# EAGLE design BSE_APPS_Error_Detection (EAGLE 8.4.1)
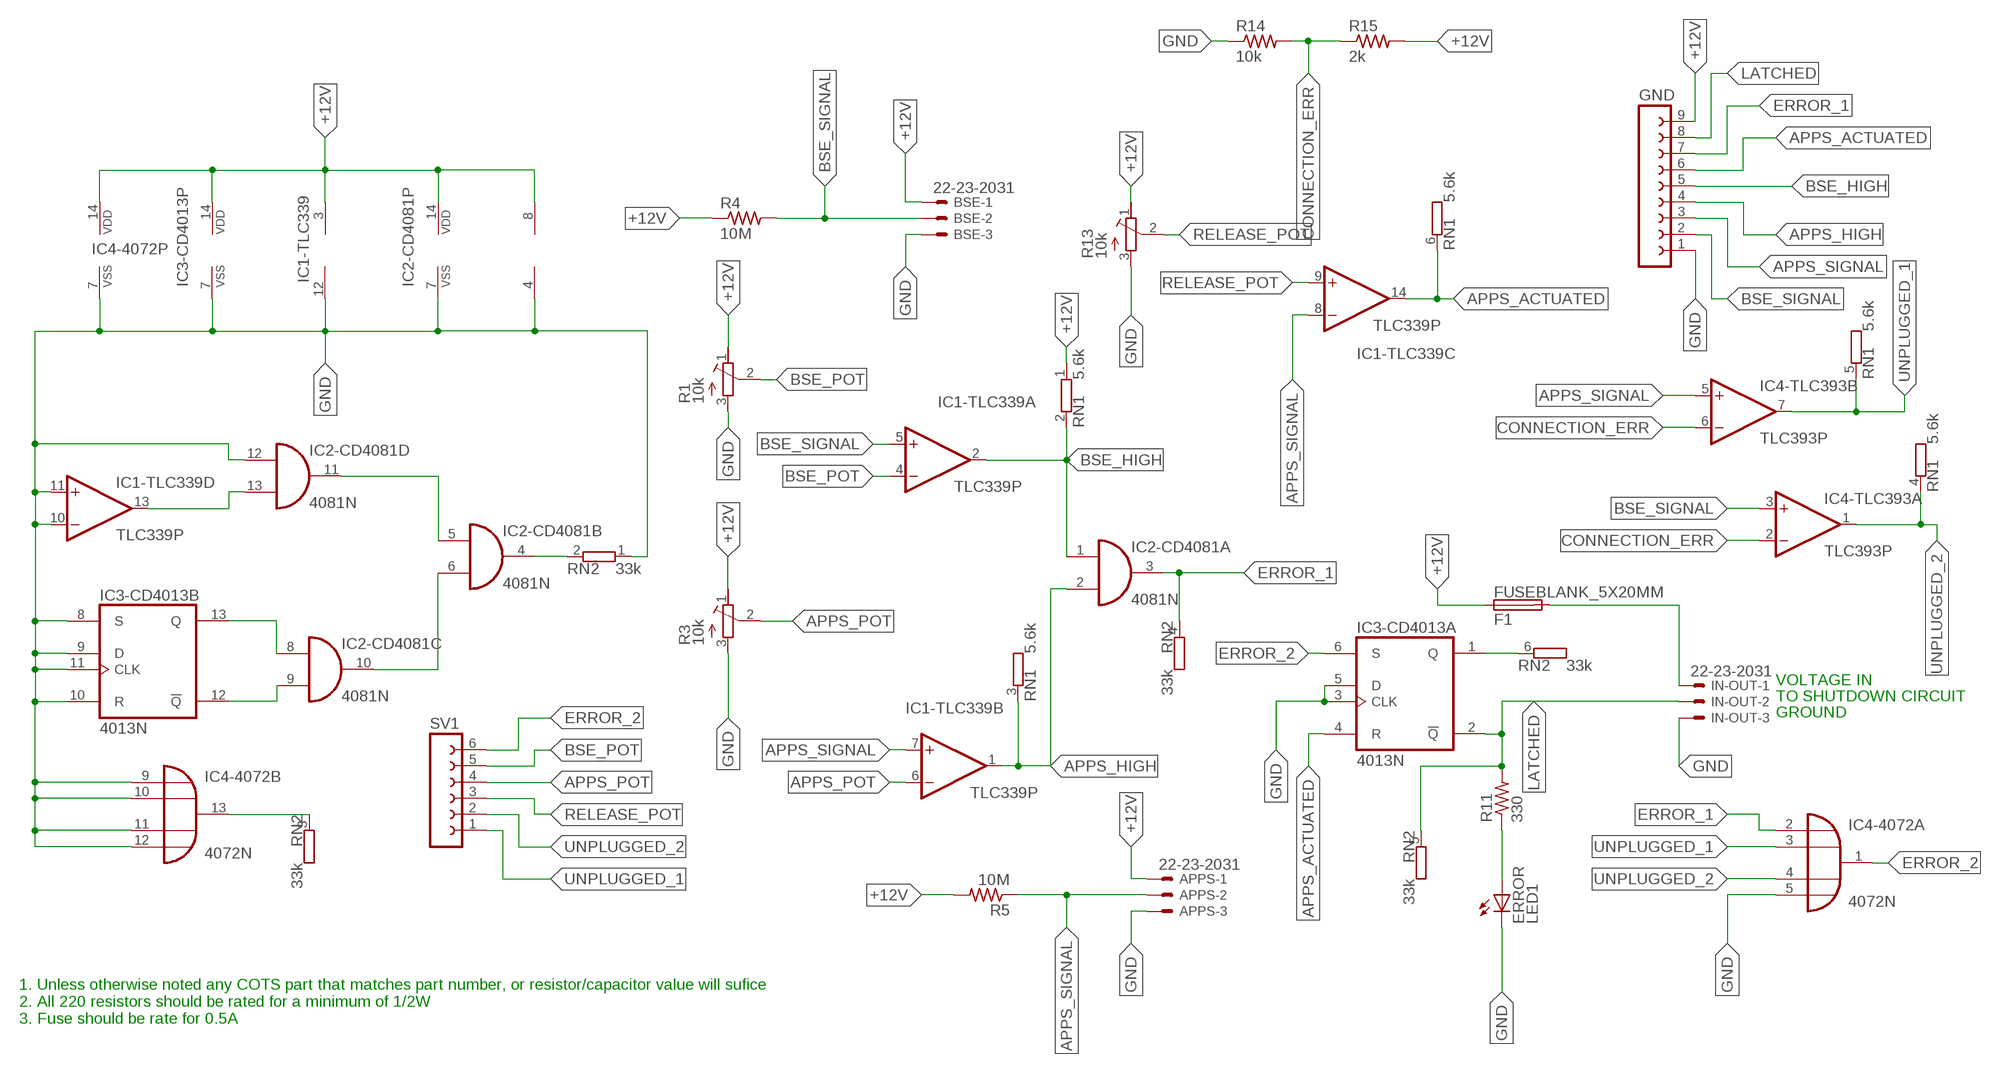
[diagram p0: schematic, sheet 1]

## Parts
APPS  22-23-2031  [22-23-2031]
BSE  22-23-2031  [22-23-2031]
ERROR  LED1  LED5MM  [LED5MM]
F1  FUSEBLANK_5X20MM  [FUSE_HOLDER_5X20MM]
GND  FE09W  [FE09W]
IC1-TLC339  TLC339P  [DIL14]
IC2-CD4081  4081N  [DIL14]
IC3-CD4013  4013N  [DIL14]
IC4-4072  4072N  [DIL14]
IC4-TLC393  TLC393P  [DIL08]
IN-OUT  22-23-2031  [22-23-2031]
R1  10k  R-TRIMM3006P  [RTRIM3006P]
R3  10k  R-TRIMM3006P  [RTRIM3006P]
R4  10M  R-US_0207/10  [0207/10]
R5  10M  R-US_0207/10  [0207/10]
R11  330  R-US_0207/10  [0207/10]
R13  10k  R-TRIMM3006P  [RTRIM3006P]
R14  10k  R-US_0207/10  [0207/10]
R15  2k  R-US_0207/10  [0207/10]
RN1  5.6k  GE05RP  [SIL6]
RN2  33k  GE05RP  [SIL6]
SV1  FE06W  [FE06W]

## Nets
+12V: APPS.1 BSE.1 F1.1 GND.9 IC1-TLC339.3(P:V+) IC2-CD4081.14(P:VDD) IC3-CD4013.14(P:VDD) IC4-4072.14(P:VDD) IC4-TLC393.8(P:V+) R1.1(E) R3.1(E) R4.1 R5.2 R13.1(E) R15.2 RN1.1
APPS_ACTUATED: GND.6 IC1-TLC339.14(C:OUT) IC3-CD4013.4(A:R) RN1.6
APPS_HIGH: GND.4 IC1-TLC339.1(B:OUT) IC2-CD4081.2(A:I1) RN1.3
APPS_POT: IC1-TLC339.6(B:-IN) R3.2(S) SV1.4
APPS_SIGNAL: APPS.2 GND.3 IC1-TLC339.7(B:+IN) IC1-TLC339.8(C:-IN) IC4-TLC393.5(B:+IN) R5.1
BSE_HIGH: GND.5 IC1-TLC339.2(A:OUT) IC2-CD4081.1(A:I0) RN1.2
BSE_POT: IC1-TLC339.4(A:-IN) R1.2(S) SV1.5
BSE_SIGNAL: BSE.2 GND.2 IC1-TLC339.5(A:+IN) IC4-TLC393.3(A:+IN) R4.2
CONNECTION_ERR: IC4-TLC393.2(A:-IN) IC4-TLC393.6(B:-IN) R14.2 R15.1
ERROR_1: GND.7 IC2-CD4081.3(A:O) IC4-4072.2(A:I0) RN2.4
ERROR_2: IC3-CD4013.6(A:S) IC4-4072.1(A:O) SV1.6
GND: APPS.3 BSE.3 ERROR.K(C) GND.1 IC1-TLC339.10(D:-IN) IC1-TLC339.11(D:+IN) IC1-TLC339.12(P:V-) IC2-CD4081.7(P:VSS) IC2-CD4081.12(D:I0) IC3-CD4013.3(A:CLK) IC3-CD4013.5(A:D) IC3-CD4013.7(P:VSS) IC3-CD4013.8(B:S) IC3-CD4013.9(B:D) IC3-CD4013.10(B:R) IC3-CD4013.11(B:CLK) IC4-4072.5(A:I3) IC4-4072.7(P:VSS) IC4-4072.9(B:I0) IC4-4072.10(B:I1) IC4-4072.11(B:I2) IC4-4072.12(B:I3) IC4-TLC393.4(P:V-) IN-OUT.3 R1.3(A) R3.3(A) R13.3(A) R14.1 RN2.1
LATCHED: GND.8 IC3-CD4013.2(A:!Q) IN-OUT.2 R11.2 RN2.5
N$5: IC2-CD4081.6(B:I1) IC2-CD4081.10(C:O)
N$6: IC1-TLC339.13(D:OUT) IC2-CD4081.13(D:I1)
N$7: IC3-CD4013.1(A:Q) RN2.6
N$8: F1.2 IN-OUT.1
N$9: IC2-CD4081.8(C:I0) IC3-CD4013.13(B:Q)
N$10: ERROR.A R11.1
N$12: IC2-CD4081.9(C:I1) IC3-CD4013.12(B:!Q)
N$13: IC2-CD4081.5(B:I0) IC2-CD4081.11(D:O)
N$14: IC2-CD4081.4(B:O) RN2.2
N$16: IC4-4072.13(B:O) RN2.3
RELEASE_POT: IC1-TLC339.9(C:+IN) R13.2(S) SV1.3
UNPLUGGED_1: IC4-4072.3(A:I1) IC4-TLC393.7(B:OUT) RN1.5 SV1.1
UNPLUGGED_2: IC4-4072.4(A:I2) IC4-TLC393.1(A:OUT) RN1.4 SV1.2

## Notes on the sheet
- IC1-TLC339
- VOLTAGE IN
- TO SHUTDOWN CIRCUIT
- GROUND
- 1. Unless otherwise noted any COTS part that matches part number, or resistor/capacitor value will sufice
  2. All 220 resistors should be rated for a minimum of 1/2W
  3. Fuse should be rate for 0.5A

## Library data of the parts
APPS BSE IN-OUT = con-molex:22-23-2031: .100" (2.54mm) Center Header - 3 Pin; MF: MOLEX; MPN: 22-23-2031; OC_FARNELL: 1462950; OC_NEWARK: 30C0862
ERROR = led:LED: LED OSRAM: - CHIPLED LG R971, LG N971, LY N971, LG Q971, LY Q971, LO R971, LY R971 LH N974, LH R974 LS Q976, LO Q976, LY Q976 LO Q996 - Hyper CHIPLED LW Q18S LB Q993, LB Q99A, LB R99A - SideLED LS A670, LO A670, LY A670, LG A670, LP A670 LB A673, LV A673, LT A673, LW A673 LH A674 LY A675 LS A676, LA A676, LO A676, LY A676, LW A676 LS A679, LY A679, LG A679 - Hyper Micro SIDELED® LS Y876, LA Y876, LO Y876, LY Y876 LT Y87S - SmartLED LW L88C, LW L88S LB L89C, LB L89S, LG L890 LS L89K, LO L89K, LY L89K LS L896, LA L896, LO L896, LY L896 - TOPLED LS T670, LO T670, LY T670, LG T670, LP T670 LSG T670, LSP T670, LSY T670, LOP T670, LYG T670 LG T671, LOG T671, LSG T671 LB T673, LV T673, LT T673, LW T673 LH T674 LS T676, LA T676, LO T676, LY T676, LB T676, LH T676, LSB T676, LW T676 LB T67C, LV T67C, LT T67C, LS T67K, LO T67K, LY T67K, LW E67C LS E67B, LA E67B, LO E67B, LY E67B, LB E67C, LV E67C, LT E67C LW T67C LS T679, LY T679, LG T679 LS T770, LO T770, LY T770, LG T770, LP T770 LB T773, LV T773, LT T773, LW T773 LH T774 LS E675, LA E675, LY E675, LS T675 LS T776, LA T776, LO T776, LY T776, LB T776 LHGB T686 LT T68C, LB T68C - Hyper Mini TOPLED® LB M676 - Mini TOPLED Santana® LG M470 LS M47K, LO M47K, LY M47K Source: http://www.osram.convergy.de LUXEON: - LUMILED® LXK2-PW12-R00, LXK2-PW12-S00, LXK2-PW14-U00, LXK2-PW14-V00 LXK2-PM12-R00, LXK2-PM12-S00, LXK2-PM14-U00 LXK2-PE12-Q00, LXK2-PE12-R00, LXK2-PE12-S00, LXK2-PE14-T00, LXK2-PE14-U00 LXK2-PB12-K00, LXK2-PB12-L00, LXK2-PB12-M00, LXK2-PB14-N00, LXK2-PB14-P00, LXK2-PB14-Q00 LXK2-PR12-L00, LXK2-PR12-M00, LXK2-PR14-Q00, LXK2-PR14-R00 LXK2-PD12-Q00, LXK2-PD12-R00, LXK2-PD12-S00 LXK2-PH12-R00, LXK2-PH12-S00 LXK2-PL12-P00, LXK2-PL12-Q00, LXK2-PL12-R00 Source: www.luxeon.com KINGBRIGHT: KA-3528ASYC Source: www.kingbright.com
F1 = fuse:FUSE: Fuse; OC_FARNELL: unknown; OC_NEWARK: unknown
GND = con-lsta:FE09W: FEMALE HEADER; OC_FARNELL: unknown; OC_NEWARK: unknown
IC1-TLC339 = linear:TLC339: COMPARATOR
IC2-CD4081 = 40xx:4081: Quad 2-input AND
IC3-CD4013 = 40xx:4013: Dual D FLIP FLOP, set/reset
IC4-4072 = 40xx:4072: Dual 4-input OR
IC4-TLC393 = linear:TLC393: COMPARATOR
R1 R3 R13 = rcl:R-TRIMM: Trimm resistor; SPICEMODEL: X; SPICEPREFIXL: POT
R4 R5 R11 R14 R15 = resistor:R-US_: RESISTOR, American symbol
RN1 RN2 = resistor-sil:GE05RP: SIL RESISTOR; OC_FARNELL: unknown; OC_NEWARK: unknown
SV1 = con-lsta:FE06W: FEMALE HEADER; OC_FARNELL: unknown; OC_NEWARK: unknown

## Board
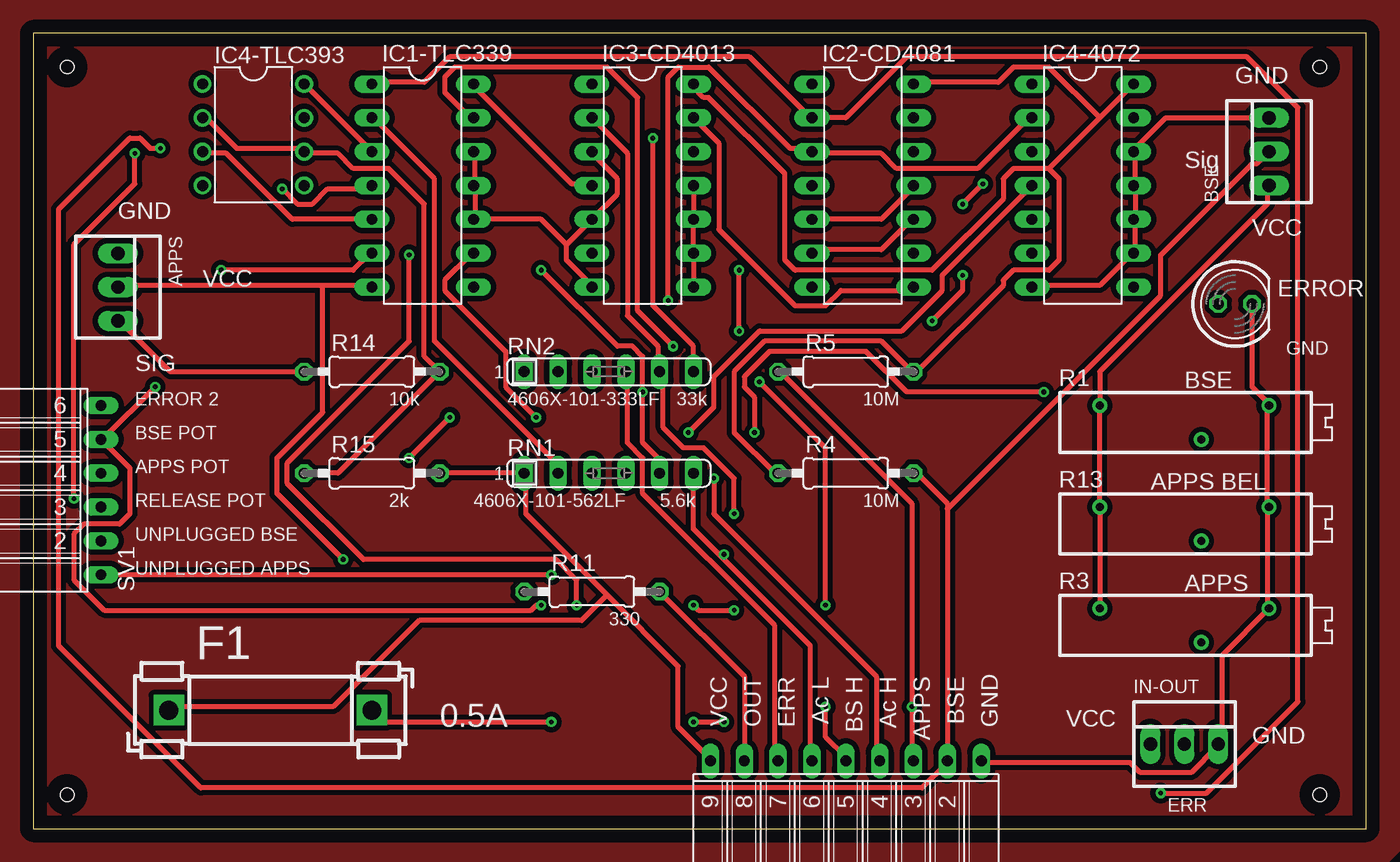
[diagram p1: board, top side]
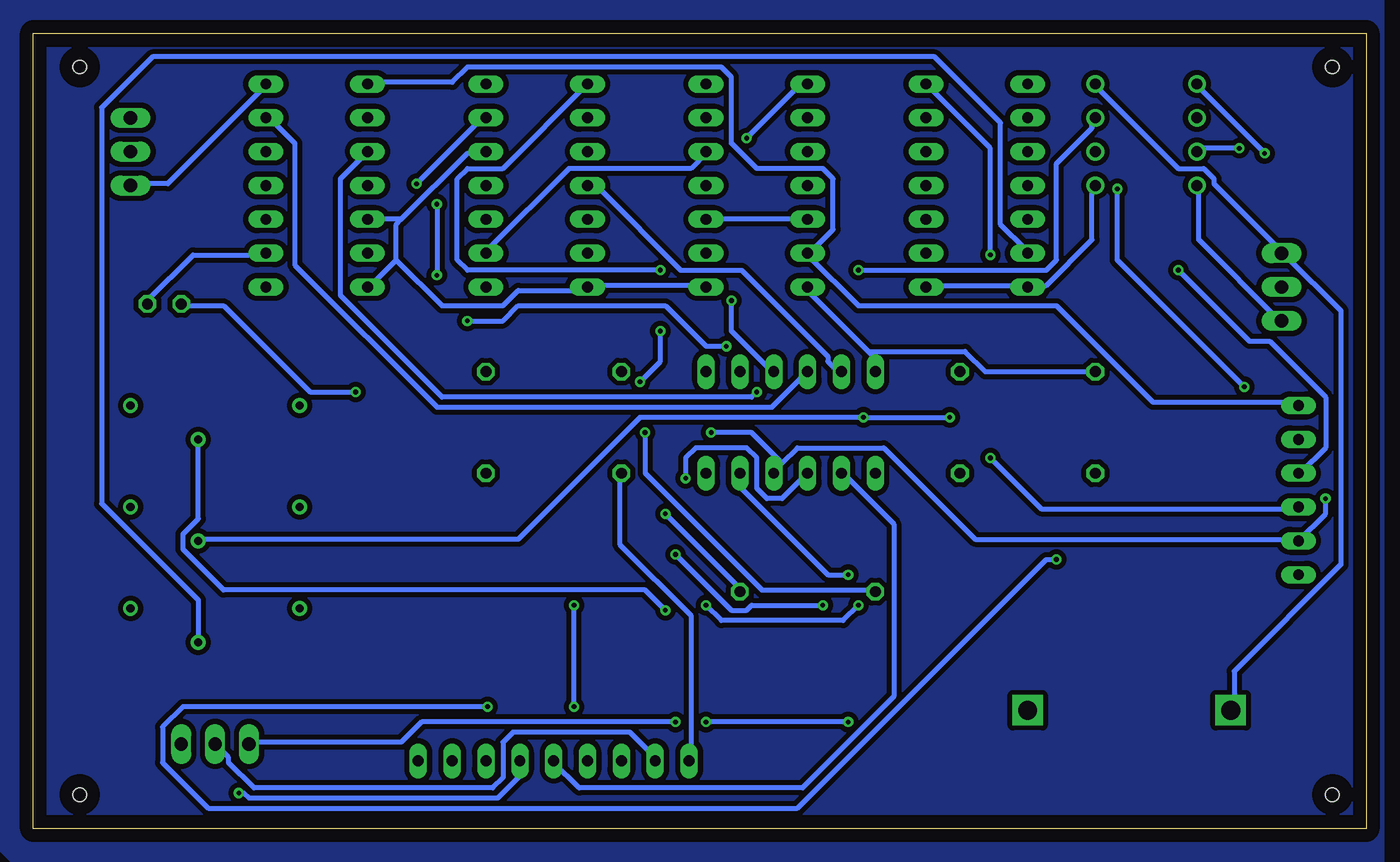
[diagram p2: board, bottom side, seen from below]

Size 100 x 59.68 mm. Coordinates in mm from the lower left corner, seen from the top.
Outline: 0,0 100,0 100,59.68 0,59.68 0,0
Copper layers (1*16): Top 0.035mm / dielectric 1.5mm / Bottom 0.035mm
Design rules "default *": minimum track width 15mil, minimum drill 0.35mm, track to track 15mil, track to pad 15mil, pad to pad 15mil, via to via 15mil, smd to smd 6mil, copper to edge 40mil, drill to drill 6mil, minimum pad ring 10mil, minimum via ring 8mil, stop-mask expansion 4mil, vias tented up to drill 0mil, thermal gap 10mil
Holes 1 mm at 2.54,57.15 2.54,2.54 96.52,2.54 96.52,57.15

### Footprints (pad centres in the part's own frame; a part is rotated, then mirrored left to right if it is on the bottom)
22-23-2031 = drill 1 long: 1 -2.54,0; 2 0,0; 3 2.54,0
LED5MM = drill 0.813 octagon: A -1.27,0; K 1.27,0
FUSE_HOLDER_5X20MM = drill 1.422 pad 2.286 square: 1 0,0; 2 15.24,0
FE09W = drill 0.813 long: 1 -10.16,0; 2 -7.62,0; 3 -5.08,0; 4 -2.54,0; 5 0,0; 6 2.54,0; 7 5.08,0; 8 7.62,0; 9 10.16,0
DIL14 = drill 0.813 long: 1 -7.62,-3.81; 2 -5.08,-3.81; 3 -2.54,-3.81; 4 0,-3.81; 5 2.54,-3.81; 6 5.08,-3.81; 7 7.62,-3.81; 8 7.62,3.81; 9 5.08,3.81; 10 2.54,3.81; 11 0,3.81; 12 -2.54,3.81; 13 -5.08,3.81; 14 -7.62,3.81
DIL08 = drill 0.813 pad 1.27: 1 -3.81,-3.81; 2 -1.27,-3.81; 3 1.27,-3.81; 4 3.81,-3.81; 5 3.81,3.81; 6 1.27,3.81; 7 -1.27,3.81; 8 -3.81,3.81
RTRIM3006P = drill 0.61: 1 -7.62,1.27; 2 0,-1.27; 3 5.08,1.27
0207/10 = drill 0.813 octagon: 1 -5.08,0; 2 5.08,0
SIL6 = drill 0.813 long: 1 -6.35,0; 2 -3.81,0; 3 -1.27,0; 4 1.27,0; 5 3.81,0; 6 6.35,0
FE06W = drill 0.813 long: 1 -6.35,0; 2 -3.81,0; 3 -1.27,0; 4 1.27,0; 5 3.81,0; 6 6.35,0

### Placement (x,y rotation side)
APPS  6.35,40.64 270 top
BSE  92.71,50.8 90 top
ERROR  90.17,39.37 0 top
F1  10.16,8.89 0 top
GND  60.96,5.08 180 top
IC1-TLC339  29.21,48.26 270 top
IC2-CD4081  62.23,48.26 270 top
IC3-CD4013  45.72,48.26 270 top
IC4-4072  78.74,48.26 270 top
IC4-TLC393  16.51,52.07 270 top
IN-OUT  86.36,6.35 0 top
R1  87.63,30.48 0 top
R3  87.63,15.24 0 top
R4  60.96,26.67 0 top
R5  60.96,34.29 0 top
R11  41.91,17.78 0 top
R13  87.63,22.86 0 top
R14  25.4,34.29 0 top
R15  25.4,26.67 0 top
RN1  43.18,26.67 0 top
RN2  43.18,34.29 0 top
SV1  5.08,25.4 90 top

### Tracks (layer width: path | path; a pad name or v marks a point on that pad's centre or on a via)
+12V
  Top 0.381: IC4-TLC393.8 IC1-TLC339.3 | R15.2 RN1.1 36.96,26.67 36.96,23.62 43.05,17.53 | 43.05,17.53 48.39,12.19 48.39,7.62 50.67,5.33 GND.9 | R3.1 R13.1 R1.1 80.01,34.29 92.58,46.86 92.58,48.01 BSE.1 | 76.2,49.53 73.53,49.53 72.77,48.77 72.77,47.24 67.44,41.91 57.15,41.91 56.39,42.67 56.39,49.15 50.67,54.86 50.29,54.86 49.53,55.63 IC3-CD4013.14 | IC4-4072.14 80.01,53.34 | 80.01,53.34 76.2,49.53 | 76.2,49.53 76.96,48.77 76.96,42.67 76.2,41.91 73.53,41.91 72.77,41.15 72.77,40.77 66.29,34.29 R5.2 65.91,34.29 63.63,36.58 54.86,36.58 52.58,34.29 52.58,29.72 55.63,26.67 R4.1 | 80.01,53.34 76.2,57.15 73.53,57.15 72.39,56.01 66.29,56.01 IC2-CD4081.14 | 43.05,17.53 41.15,15.62 28.96,15.62 22.48,9.14 10.29,9.14 F1.1
  Bottom 0.381: IC4-TLC393.8 20.19,55.63 14.1,49.53 12.19,49.53 11.43,48.77 11.43,48.39 6.48,43.43 APPS.1 6.1,43.05 1.91,38.86 1.91,19.81 9.91,11.81 9.91,9.14 F1.1 | GND.9 50.67,5.33 50.67,16 56.01,21.34 56.01,26.67 R4.1 | BSE.1 92.58,48.39 89.92,48.39 82.68,55.63 IC4-4072.14
APPS_ACTUATED  (via drill 0.35)
  Top 0.381: IC3-CD4013.4 41.91,48.39 40.39,48.39 33.15,55.63 IC1-TLC339.14 | RN1.6 49.53,22.48 51.44,20.57 | 51.44,20.57 58.29,13.72 58.29,5.33 GND.6 | v28.19,43.05 28.19,36.58 19.05,27.43 19.05,25.91 24.77,20.19 39.24,20.19 40.77,18.67 v40.77,16.76 | 51.44,20.57 v51.82,20.57
  Bottom 0.381: IC1-TLC339.14 28.19,51.05 v28.19,43.05 | v40.77,16.76 46.1,16.76 46.48,16.38 47.62,16.38 v51.82,20.57
APPS_HIGH  (via drill 0.35)
  Top 0.381: v51.05,26.29 51.05,23.62 63.25,11.43 63.25,5.33 GND.4 | v84.58,2.67 88.01,2.67 94.87,9.53 94.87,54.1 91.06,57.91 65.53,57.91 60.96,53.34 IC2-CD4081.2 58.29,53.34 53.72,57.91 31.24,57.91 29.34,56.01 25.53,56.01 IC1-TLC339.1
  Bottom 0.381: v51.05,26.29 51.05,27.81 50.29,28.57 46.48,28.57 45.72,27.81 45.72,25.53 44.96,24.77 43.81,24.77 RN1.3 | v84.58,2.67 84.2,2.67 83.82,2.29 65.15,2.29 63.63,3.81 63.63,4.95 GND.4
APPS_POT  (via drill 0.35)
  Top 0.381: v14.1,41.91 24,41.91 25.15,43.05 IC1-TLC339.6
  Bottom 0.381: R3.2 87.63,17.14 94.87,24.38 94.87,54.1 91.06,57.91 32.38,57.91 27.43,52.96 27.43,45.34 25.53,43.43 IC1-TLC339.6 | v14.1,41.91 8.76,36.58 7.24,36.58 3.05,32.38 3.05,28.57 4.95,26.67 SV1.4
APPS_SIGNAL  (via drill 0.35)
  Top 0.381: 21.72,40.77 25.15,40.77 IC1-TLC339.7 | 21.72,40.77 6.48,40.77 APPS.2 | GND.3 65.91,5.33 v65.91,9.14 65.91,24.38 56.01,34.29 R5.1 | 21.72,40.77 21.72,31.24 18.29,27.81 18.29,25.15 v23.24,20.19
  Bottom 0.381: IC1-TLC339.8 32.77,40.77 25.53,40.77 IC1-TLC339.7 25.15,40.77 24,40.77 20.57,44.2 20.57,48.01 IC4-TLC393.5 | v23.24,20.19 24,20.19 42.67,1.52 86.87,1.52 90.3,4.95 90.3,7.62 88.77,9.14 v65.91,9.14
BSE_HIGH  (via drill 0.35)
  Top 0.381: IC1-TLC339.2 25.53,53.34 30.1,48.77 30.1,36.58 39.24,27.43 39.24,26.67 RN1.2 | v52.96,37.34 v52.96,41.91 | v54.48,33.53 59.44,28.57 v59.44,16.76 | v59.44,9.14 59.44,6.86 60.96,5.33 GND.5
  Bottom 0.381: GND.5 60.96,4.95 59.05,3.05 42.29,3.05 35.43,9.91 35.43,22.86 39.24,26.67 RN1.2 | IC2-CD4081.1 64.77,49.53 67.44,49.53 68.2,48.77 68.2,42.67 67.44,41.91 v52.96,41.91 | v52.96,37.34 52.96,35.05 v54.48,33.53 | v59.44,9.14 v59.44,16.76
BSE_POT  (via drill 0.35)
  Top 0.381: v52.58,16.38 49.91,16.38 v49.53,16.76 | v38.1,16.76 37.72,16.76 37.34,16.38 5.33,16.38 3.05,18.67 3.05,22.1 3.81,22.86 6.48,22.86 7.24,23.62 7.24,27.05 SV1.5 5.33,29.34 v9.14,33.15 | v18.67,48.01 19.81,46.86 20.95,46.86 22.1,48.01 25.15,48.01 IC1-TLC339.4
  Bottom 0.381: R1.2 87.63,23.24 88.77,22.1 88.77,20.95 85.72,17.91 54.1,17.91 v52.58,16.38 | v49.53,16.76 48.39,15.62 39.24,15.62 v38.1,16.76 | v18.67,48.01 18.67,42.67 v9.14,33.15
BSE_SIGNAL  (via drill 0.35)
  Top 0.381: IC1-TLC339.5 19.43,45.72 14.48,50.67 12.95,50.67 IC4-TLC393.3 | 68.58,24 68.58,24.38 66.29,26.67 R4.2 | 68.58,24 GND.2 68.58,4.95 66.67,3.05 12.57,3.05 1.91,13.72 1.91,46.48 7.24,51.82 8,51.82 8.76,51.05 v9.53,51.05 | BSE.2 91.82,49.91 91.44,49.91 84.58,43.05 84.58,40.01 68.58,24
  Bottom 0.381: v9.53,51.05 12.57,51.05 IC4-TLC393.3
CONNECTION_ERR
  Top 0.381: IC4-TLC393.2 12.95,53.34 15.24,51.05 20.19,51.05 IC4-TLC393.6 20.57,50.67 22.86,50.67 24,49.53 26.67,49.53 29.34,46.86 29.34,35.43 R14.2 22.86,26.67 R15.1
ERROR_1  (via drill 0.35)
  Top 0.381: IC4-4072.2 74.68,53.34 70.87,49.53 64.77,49.53 63.63,50.67 58.67,50.67 IC2-CD4081.3 58.29,51.05 56.77,51.05 50.67,57.15 48.39,57.15 47.62,56.39 v47.62,39.62 | RN2.4 44.58,34.29 44.58,28.96 45.72,27.81 45.72,25.15 55.63,15.24 55.63,5.33 GND.7
  Bottom 0.381: v47.62,39.62 47.62,37.34 44.58,34.29 RN2.4
ERROR_2
  Bottom 0.381: 41.91,43.05 38.1,39.24 23.24,39.24 16,32 5.33,32 SV1.6 | 41.91,43.05 40.01,44.96 40.01,48.77 40.77,49.53 45.72,49.53 47.62,51.44 47.62,56.39 48.39,57.15 67.44,57.15 68.58,56.01 74.68,56.01 IC4-4072.1 | 41.91,43.05 IC3-CD4013.6
GND
  Top 0.381: IC3-CD4013.11 IC3-CD4013.10 IC3-CD4013.9 IC3-CD4013.8 | 33.15,45.72 33.15,48.01 IC1-TLC339.11 33.15,48.39 33.15,50.67 IC1-TLC339.12 | 40.01,43.81 IC3-CD4013.5 43.81,47.62 43.81,48.77 41.91,50.67 IC3-CD4013.3 | 40.01,43.81 40.01,42.67 41.91,40.77 IC3-CD4013.7 | 33.15,45.72 38.1,45.72 40.01,43.81 | 33.15,45.72 IC1-TLC339.10 | 82.68,45.72 82.68,48.01 IC4-4072.11 82.68,48.39 82.68,50.67 IC4-4072.12 82.68,51.05 84.96,53.34 BSE.3 | IC4-4072.7 75.06,40.77 80.01,40.77 82.3,43.05 IC4-4072.9 82.68,43.43 82.68,45.72 | 82.68,45.72 IC4-4072.10 | GND.1 71.25,4.95 82.3,4.95 83.06,4.19 86.87,4.19 88.77,6.1 IN-OUT.3 89.15,6.48 89.15,12.95 R3.3 92.58,16.76 92.58,24 R13.3 92.58,24.38 92.58,31.62 R1.3 92.58,32 91.44,33.15 ERROR.K | R14.1 10.29,34.29 6.48,38.1 APPS.3
  Bottom 0.381: IC3-CD4013.8 49.53,40.77 58.29,40.77 IC2-CD4081.7 58.67,40.39 63.63,40.39 64.77,39.24 69.34,39.24 72.77,42.67 | 37.34,35.81 41.91,40.39 IC3-CD4013.7 | 37.34,35.81 36.96,35.43 36.96,34.29 RN2.1 | IC3-CD4013.5 IC3-CD4013.10 | 72.39,45.72 72.77,45.34 72.77,42.67 | 72.39,45.72 67.44,50.67 66.29,50.67 IC2-CD4081.12 | 72.77,42.67 74.68,40.77 IC4-4072.7 | IC4-4072.9 82.68,43.05 88.01,43.05 91.44,39.62 ERROR.K | 72.39,45.72 IC4-4072.5 | IC4-TLC393.4 12.57,48.01 12.57,44.2 6.48,38.1 APPS.3 | R14.1 28.57,34.29 30.1,35.81 37.34,35.81
LATCHED  (via drill 0.35)
  Top 0.381: IC3-CD4013.2 44.58,50.67 44.58,38.48 46.86,36.2 46.86,34.29 RN2.5 47.24,34.29 47.24,30.1 48.77,28.57 50.29,28.57 52.58,26.29 v52.58,23.62 | GND.8 53.34,11.43 R11.2
  Bottom 0.381: IN-OUT.2 85.34,5.33 85.34,4.95 83.44,3.05 65.53,3.05 64.77,3.81 64.77,6.48 64.01,7.24 55.24,7.24 53.34,5.33 GND.8 | v52.58,23.62 46.86,17.91 R11.2
N$1
  pour Top: -2.54,62.23 -2.54,-3.81 -3.81,-5.08 99.06,-5.08 105.41,1.27 105.41,59.69 101.6,63.5 100.33,62.23
N$2
  pour Bottom: -1.27,63.5 -1.27,-3.81 100.33,-3.81 105.41,1.27 105.41,2.54 105.41,59.69 101.6,63.5
N$5
  Top 0.381: IC2-CD4081.6 58.67,43.43 63.63,43.43 65.91,45.72 IC2-CD4081.10
N$6  (via drill 0.35)
  Top 0.381: v48.01,36.2 45.34,38.86 45.34,54.86 43.05,57.15 31.62,57.15 30.86,56.39 30.86,55.24 32.77,53.34 IC1-TLC339.13 | v67.44,38.1 69.72,40.39 v69.72,41.53 | v71.25,48.39 v69.72,46.86
  Bottom 0.381: v48.01,36.2 49.53,36.2 52.58,39.24 63.63,39.24 64.77,38.1 v67.44,38.1 | v69.72,46.86 v69.72,41.53 | v71.25,48.39 66.29,53.34 IC2-CD4081.13
N$7  (via drill 0.35)
  Top 0.381: v46.48,51.82 46.48,39.24 49.53,36.2 RN2.6
  Bottom 0.381: v46.48,51.82 42.67,55.63 41.91,55.63 IC3-CD4013.1
N$8  (via drill 0.35)
  Top 0.381: v49.53,8 v51.82,8 | v38.86,8 26.29,8 F1.2
  Bottom 0.381: v51.82,8 70.87,8 72.39,6.48 83.82,6.48 IN-OUT.1 | v38.86,8 v49.53,8
N$9
  Top 0.381: IC3-CD4013.13 51.44,51.44 51.44,44.96 57.15,39.24 59.44,39.24 60.58,40.39 65.91,40.39 IC2-CD4081.8
N$10  (via drill 0.35)
  Top 0.381: v54.1,29.72 54.1,32.38 53.34,33.15 53.34,33.91 55.24,35.81 62.48,35.81 65.53,32.77 v75.82,32.77
  Bottom 0.381: v54.1,29.72 54.1,26.67 45.34,17.91 36.96,17.91 R11.1 | v75.82,32.77 79.25,32.77 85.72,39.24 88.77,39.24 ERROR.A
N$12
  Bottom 0.381: IC2-CD4081.9 65.91,43.43 59.82,49.53 50.67,49.53 49.53,50.67 IC3-CD4013.12
N$13
  Top 0.381: IC2-CD4081.5 63.63,45.72 65.91,48.01 IC2-CD4081.11
N$14
  Bottom 0.381: RN2.2 39.62,34.29 40.39,35.05 40.39,35.43 46.86,41.91 51.44,41.91 57.53,48.01 58.29,48.01 IC2-CD4081.4
N$16
  Bottom 0.381: RN2.3 44.58,31.62 69.72,31.62 80.39,42.29 80.39,51.44 82.3,53.34 IC4-4072.13
RELEASE_POT  (via drill 0.35)
  Top 0.381: v37.72,30.86 35.43,33.15 35.43,35.81 30.86,40.39 30.86,41.15 32.77,43.05 IC1-TLC339.9 | v31.24,30.86 v28.19,27.81
  Bottom 0.381: R13.2 87.63,21.72 63.63,21.72 54.48,30.86 v37.72,30.86 v31.24,30.86 | v28.19,27.81 24.38,24 5.33,24 SV1.3
UNPLUGGED_1  (via drill 0.35)
  Top 0.381: v38.86,19.05 SV1.1 | RN1.5 46.86,26.67 46.86,27.81 45.72,28.96 v45.72,32.77 45.72,35.43 44.96,36.2 43.81,36.2 v38.1,41.91
  Bottom 0.381: v38.86,19.05 40.39,19.05 46.86,25.53 46.86,26.67 RN1.5 | IC4-4072.3 76.96,48.77 76.96,40.01 69.34,32.38 46.1,32.38 v45.72,32.77 | v38.1,41.91 24,41.91 23.24,42.67 23.24,49.91 20.57,52.58 20.57,53.34 IC4-TLC393.7
UNPLUGGED_2  (via drill 0.35)
  Top 0.381: v7.62,50.67 7.62,48.39 3.05,43.81 v3.05,24.77 | IC4-4072.4 68.2,41.53 68.2,40.39 65.15,37.34 54.48,37.34 51.05,33.91 51.05,31.62 v49.15,29.72
  Bottom 0.381: 43.81,27.43 44.58,26.67 RN1.4 43.81,27.43 | 43.81,27.43 42.67,28.57 36.2,28.57 29.34,21.72 5.33,21.72 SV1.2 3.05,23.62 v3.05,24.77 | v7.62,50.67 12.57,55.63 IC4-TLC393.1 | v49.15,29.72 46.1,29.72 43.81,27.43

### Text on the board
tNames: GND | Sig | GND | VCC | VCC | GND | SIG | BSE | ERROR 2 | 10k | 4606X-101-333LF | 33k | 10M | BSE POT | APPS POT | APPS BEL | RELEASE POT | 2k | 4606X-101-562LF | 5.6k | 10M | UNPLUGGED BSE | UNPLUGGED APPS | APPS | 330 | VCC | OUT | ERR | Ac L | BS H | Ac H | APPS | BSE | 0.5A | VCC | GND | ERR